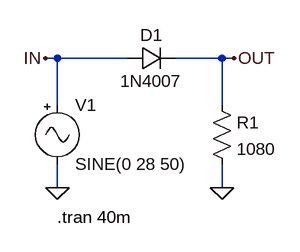
[diagram p0: schematic prostownik_jednopolowkowy_lista4.asc]
prostownik_jednopolowkowy_lista4.asc, the LTspice schematic file:
Version 4.1
SHEET 1 880 680
WIRE 64 48 48 48
WIRE 160 48 64 48
WIRE 288 48 224 48
WIRE 304 48 288 48
WIRE 64 112 64 48
WIRE 288 112 288 48
WIRE 64 224 64 192
WIRE 288 224 288 192
FLAG 288 224 0
FLAG 64 224 0
FLAG 48 48 IN
FLAG 304 48 OUT
SYMBOL res 272 96 R0
SYMATTR InstName R1
SYMATTR Value 1080
SYMBOL Misc\\signal 64 96 R0
WINDOW 123 0 0 Left 0
WINDOW 39 0 0 Left 0
SYMATTR InstName V1
SYMATTR Value SINE(0 28 50)
SYMBOL diode 160 64 R270
WINDOW 0 32 32 VTop 2
WINDOW 3 0 32 VBottom 2
SYMATTR InstName D1
SYMATTR Value 1N4007
TEXT 64 264 Left 2 !.tran 40m

The netlist it stands for:
* prostownik_jednopolowkowy_lista4.asc
R1 OUT 0 1080
V1 IN 0 SINE(0 28 50)
D1 IN OUT 1N4007
.model D D
.lib standard.dio
.tran 40m
.backanno
.end